# Altium schematic sheet 03.Template.MCU.SchDoc
size 209 x 297 mm; PartName: Микроконтроллер; Author: Мурашкин Д.В.; DocumentNumber: _D01.R1; SheetNumber: 4; SheetTotal: 4; Scale: 1:1; Letter1Column: Э; DocumentsNumber: _D01.R1
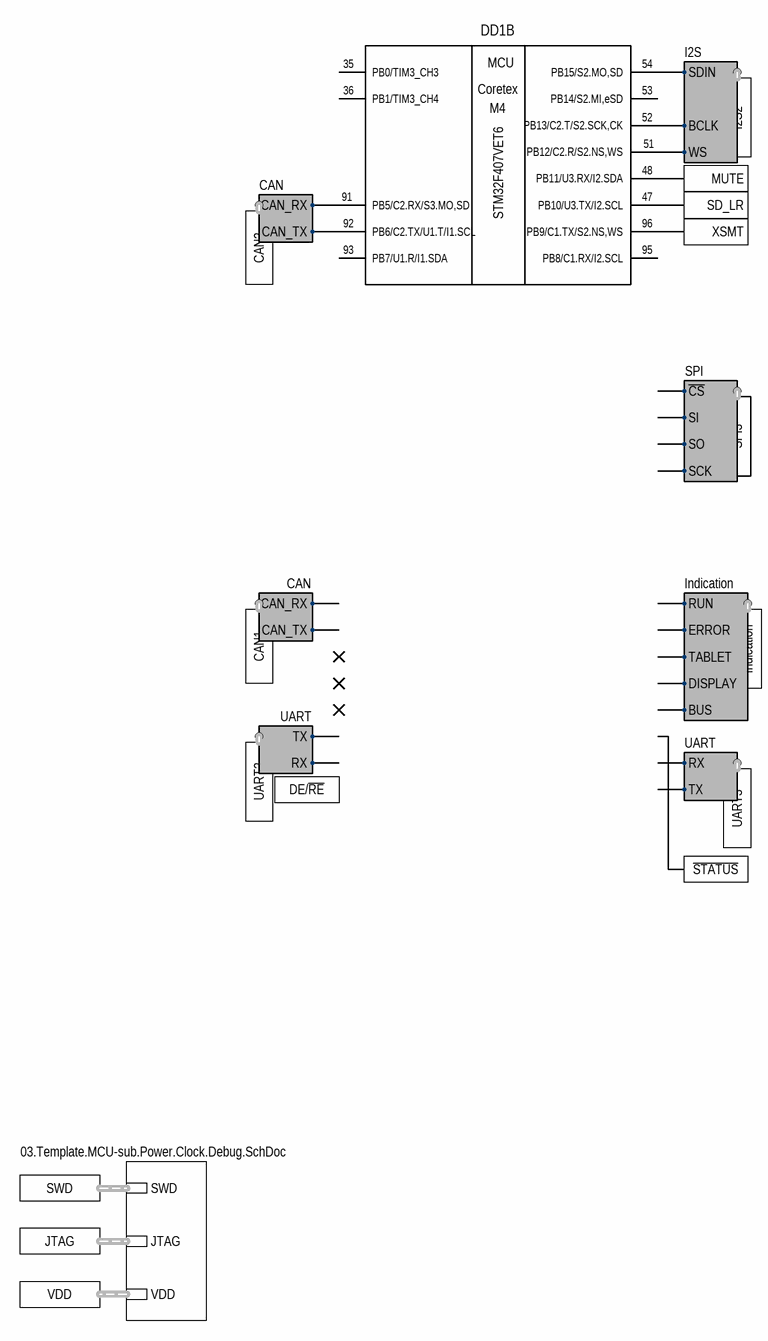
[diagram p0: 03.Template.MCU.SchDoc]

## Parts
DD1  STM32F407VET6  [LQFP-100N]  (part B of 7)

## Sub-sheets
Template.MCU-sub.Power.Clock.Debug = 03.Template.MCU-sub.Power.Clock.Debug.SchDoc: VDD (harness VDD), JTAG (harness JTAG), SWD (harness SWD)

## Ports
CAN1 (harness CAN), CAN2 (harness CAN), DE/~{RE}, I2S2 (harness I2S), Indication (harness Indication), JTAG (harness JTAG), MUTE, SD_LR, SPI3 (harness SPI), SWD (harness SWD), UART2 (harness UART), UART3 (harness UART), VDD (harness VDD), XSMT, ~{STATUS}

## Harnesses
I2S: BCLK, WS, SDIN
UART: TX, RX
CAN: CAN_RX, CAN_TX
SPI: SI, SO, SCK, ~{CS}
Indication: RUN, TABLET, ERROR, DISPLAY, BUS

## Nets
MUTE: DD1.48(PB11/U3.RX/I2.SDA) ; port MUTE
SD_LR: DD1.47(PB10/U3.TX/I2.SCL) ; port SD_LR
XSMT: DD1.96(PB9/C1.TX/S2.NS,WS) ; port XSMT
NetDD1_51: DD1.51(PB12/C2.R/S2.NS,WS) ; port I2S2.WS
NetDD1_52: DD1.52(PB13/C2.T/S2.SCK,CK) ; port I2S2.BCLK
NetDD1_54: DD1.54(PB15/S2.MO,SD) ; port I2S2.SDIN
NetDD1_91: DD1.91(PB5/C2.RX/S3.MO,SD) ; port CAN2.CAN_RX
NetDD1_92: DD1.92(PB6/C2.TX/U1.T/I1.SCL) ; port CAN2.CAN_TX

Not connected (* = marked no-connect by the designer): DD1 35(PB0/TIM3_CH3) 36(PB1/TIM3_CH4) 53(PB14/S2.MI,eSD) 93(PB7/U1.R/I1.SDA) 95(PB8/C1.RX/I2.SCL)

## Buses and harness runs
harness port JTAG = sheet Template.MCU-sub.Power.Clock.Debug/JTAG
harness port SWD = sheet Template.MCU-sub.Power.Clock.Debug/SWD
harness port VDD = sheet Template.MCU-sub.Power.Clock.Debug/VDD

## Notes on the sheet
- Подп. и дата
- Инв. № дубл.
- Взам. инв. №
- Инв. № подл.
- Изм.
- Лист
- № докум.
- Подп.
- Дата
- 2.106-A4
- Копировал
- Формат А4
- (in symbol STM32F407VET6, part B) MCU; Coretex; M4

## Library data of the parts
DD1 = STM32F407VET6: Microcontroller STM32F4 32b 168MHz 512kB Cortex-M4 LQFP-100; Manufacturer: STMicroelectronics; Core count: 1; SRAM: 192kB; Peripherals: BOD, WDT, PWM, RTC, ADC, DAC, DMA, LCD; Interfaces: GPIO, UART, SPI, JTAG, I2C, I2S, USB, CAN, LIN, DCMI, EBI/EMI, IrDA, Ethernet; Operating voltage Min: 1.8V; Operating voltage Max: 3.6V; Group: Digital; Item ID: STM32F407VET6; Part name: STM32F407VET6; Package: LQFP-100; Core: Cortex-M4; Core frequency Max: 168MHz; FLASH: 512kB; Operating temperature Min: -40°C; Operating temperature Max: +85°C; Width: 16.0mm; Length: 16.0mm; Height: 1.6mm; Mounting type: Surface mount; Supplier 1: LCSC; Supplier Part Number 1: C28730; Datasheet URL: https://www.st.com/resource/en/datasheet/stm32f407vg.pdf; Component URL: https://www.st.com/en/microcontrollers-microprocessors/stm32f407ve.html; Component: Microcontrollers; Category: STM32